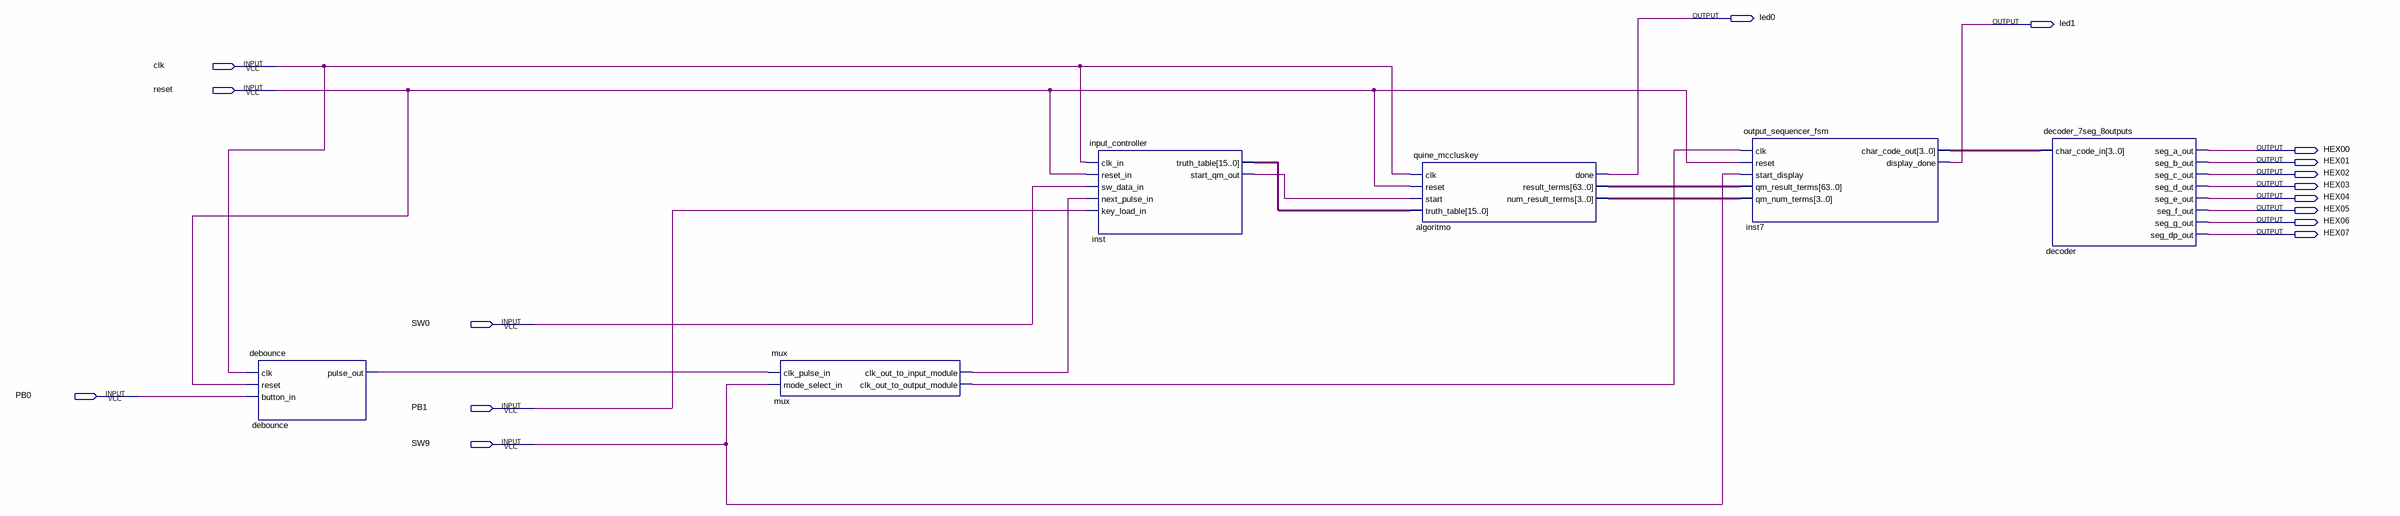
[diagram p0: schematic sheet]
// Quartus schematic ProjetoFinal.bdf as structural Verilog: 6 symbols, 16 pins
module ProjetoFinal (
  input  clk,
  input  reset,
  input  SW0,
  input  PB0,
  input  PB1,
  input  SW9,
  output led0,
  output led1,
  output HEX00,
  output HEX01,
  output HEX02,
  output HEX03,
  output HEX04,
  output HEX05,
  output HEX06,
  output HEX07
);

  wire debounce_pulse_out, inst_start_qm_out, mux_clk_out_to_input_module, mux_clk_out_to_output_module;
  wire [3:0] algoritmo_num_result_terms, inst7_char_code_out;
  wire [15:0] inst_truth_table;
  wire [63:0] algoritmo_result_terms;

  debounce debounce (.clk(clk), .reset(reset), .button_in(PB0), .pulse_out(debounce_pulse_out));
  mux mux (
    .clk_pulse_in(debounce_pulse_out), .mode_select_in(SW9),
    .clk_out_to_input_module(mux_clk_out_to_input_module),
    .clk_out_to_output_module(mux_clk_out_to_output_module));
  input_controller inst (
    .clk_in(clk), .reset_in(reset), .sw_data_in(SW0), .next_pulse_in(mux_clk_out_to_input_module),
    .key_load_in(PB1), .truth_table(inst_truth_table), .start_qm_out(inst_start_qm_out));
  quine_mccluskey algoritmo (
    .clk(clk), .reset(reset), .start(inst_start_qm_out), .truth_table(inst_truth_table), .done(led0),
    .result_terms(algoritmo_result_terms), .num_result_terms(algoritmo_num_result_terms));
  output_sequencer_fsm inst7 (
    .clk(mux_clk_out_to_output_module), .reset(reset), .start_display(SW9),
    .qm_result_terms(algoritmo_result_terms), .qm_num_terms(algoritmo_num_result_terms),
    .char_code_out(inst7_char_code_out), .display_done(led1));
  decoder_7seg_8outputs decoder (
    .char_code_in(inst7_char_code_out), .seg_a_out(HEX00), .seg_b_out(HEX01), .seg_c_out(HEX02),
    .seg_d_out(HEX03), .seg_e_out(HEX04), .seg_f_out(HEX05), .seg_g_out(HEX06), .seg_dp_out(HEX07));
endmodule
